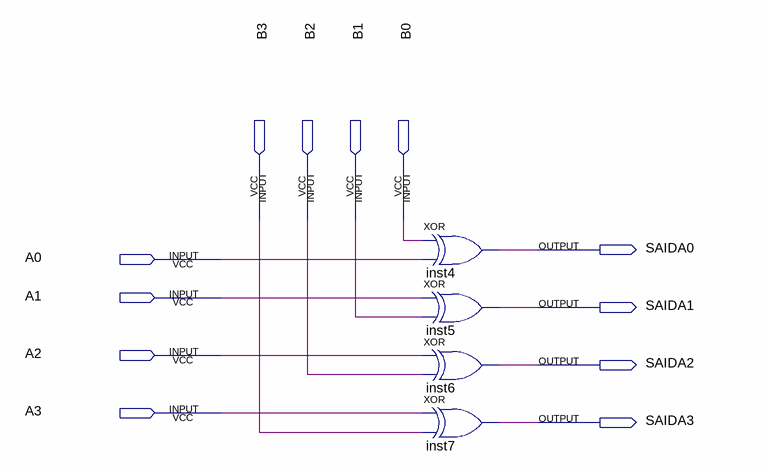
[diagram p0: schematic sheet]
// Quartus schematic ou_exclusivo.bdf as structural Verilog: 4 symbols, 12 pins
module ou_exclusivo (
  input  B3,
  input  B2,
  input  B1,
  input  B0,
  input  A0,
  input  A1,
  input  A2,
  input  A3,
  output SAIDA0,
  output SAIDA1,
  output SAIDA2,
  output SAIDA3
);

  xor inst4 (SAIDA0, B0, A0);
  xor inst5 (SAIDA1, A1, B1);
  xor inst6 (SAIDA2, A2, B2);
  xor inst7 (SAIDA3, A3, B3);
endmodule
